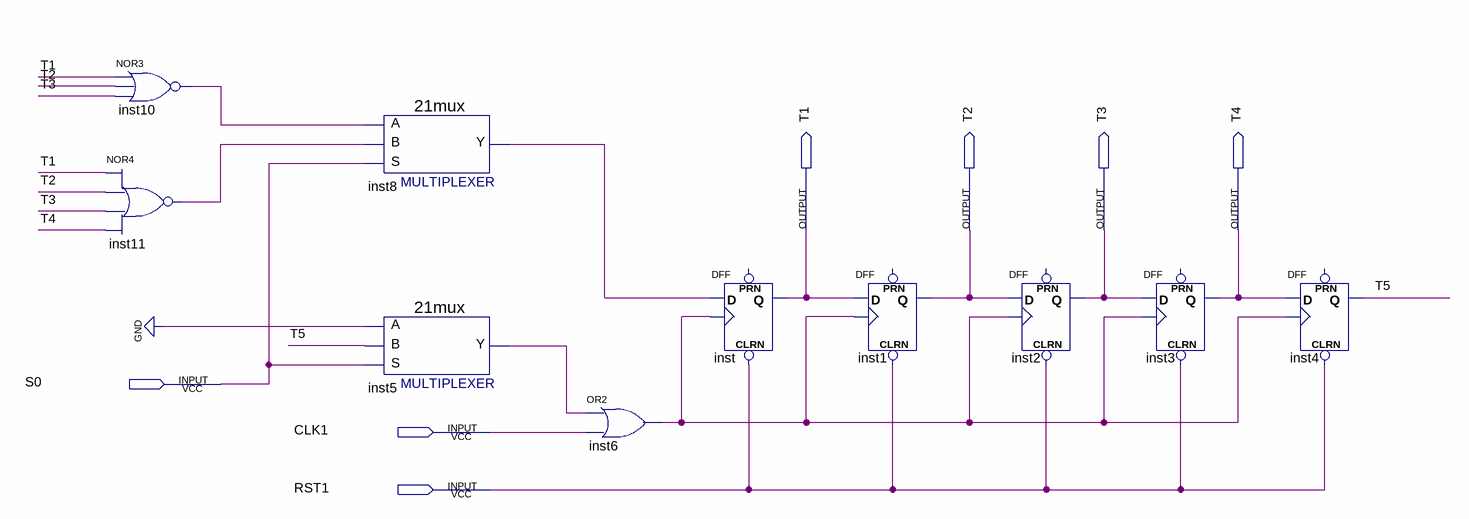
[diagram p0: schematic sheet]
// Quartus schematic BEAT.bdf as structural Verilog: 10 symbols, 7 pins
module BEAT (
  input  S0,
  input  CLK1,
  input  RST1,
  output T1,
  output T2,
  output T3,
  output T4
);

  wire inst5_y, inst6_out, inst8_y, inst10_out, inst11_out, T5;

  nor inst10 (inst10_out, T1, T2, T3);
  nor inst11 (inst11_out, T1, T2, T3, T4);
  \21mux  inst8 (.S(S0), .B(inst11_out), .A(inst10_out), .Y(inst8_y));
  \21mux  inst5 (.S(S0), .B(T5), .A(1'b0), .Y(inst5_y));
  or inst6 (inst6_out, inst5_y, CLK1);
  DFF inst (.CLRN(RST1), .CLK(inst6_out), .D(inst8_y), .Q(T1));  // open: PRN
  DFF inst1 (.CLRN(RST1), .CLK(inst6_out), .D(T1), .Q(T2));  // open: PRN
  DFF inst2 (.CLRN(RST1), .CLK(inst6_out), .D(T2), .Q(T3));  // open: PRN
  DFF inst3 (.CLRN(RST1), .CLK(inst6_out), .D(T3), .Q(T4));  // open: PRN
  DFF inst4 (.CLRN(RST1), .CLK(inst6_out), .D(T4), .Q(T5));  // open: PRN
endmodule
